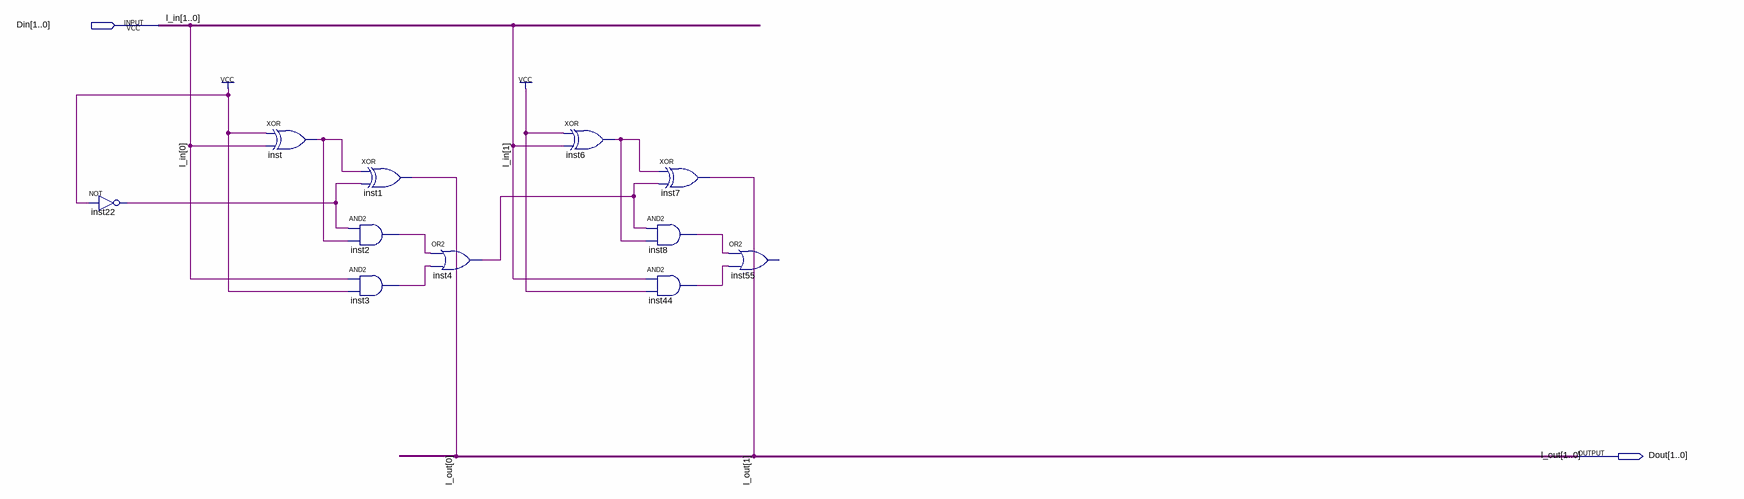
[diagram p0: schematic sheet]
// Quartus schematic decre_2bit.bdf as structural Verilog: 11 symbols, 2 pins
module decre_2bit (
  input  [1:0] Din,
  output [1:0] Dout
);

  wire inst2_out, inst3_out, inst4_out, inst6_out, inst8_out, inst22_out, inst44_out, inst_out;

  not inst22 (inst22_out, 1'b1);
  xor inst (inst_out, 1'b1, Din[0]);
  xor inst1 (Dout[0], inst_out, inst22_out);
  and inst2 (inst2_out, inst22_out, inst_out);
  and inst3 (inst3_out, Din[0], 1'b1);
  or inst4 (inst4_out, inst2_out, inst3_out);
  xor inst6 (inst6_out, 1'b1, Din[1]);
  and inst8 (inst8_out, inst4_out, inst6_out);
  and inst44 (inst44_out, Din[1], 1'b1);
  xor inst7 (Dout[1], inst6_out, inst4_out);
  // OR2 inst55 has open pins: IN1=inst8_out, IN2=inst44_out, OUT=open

  // Other names for the same wires on the sheet: l_in[1:0] = Din; l_out[1:0] = Dout
endmodule
